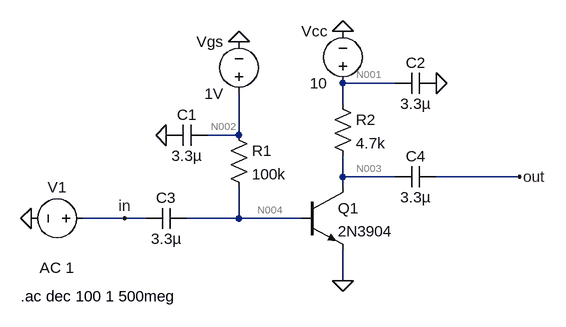
[diagram p0: schematic lab2_2N3904_CE.asc]
lab2_2N3904_CE.asc, the LTspice schematic file:
Version 4.1
SHEET 1 880 680
WIRE 304 -48 224 -48
WIRE 224 -16 224 -48
WIRE 64 32 64 -32
WIRE 64 32 16 32
WIRE 224 96 224 64
WIRE 304 96 224 96
WIRE 496 96 368 96
WIRE 224 112 224 96
WIRE -112 160 -176 160
WIRE -80 160 -112 160
WIRE 64 160 64 112
WIRE 64 160 -16 160
WIRE 160 160 64 160
WIRE 224 256 224 208
FLAG 224 256 0
FLAG 64 -112 0
FLAG 368 -48 0
FLAG -48 32 0
FLAG 496 96 out
FLAG -112 160 in
FLAG 224 -128 0
FLAG -256 160 0
SYMBOL npn 160 112 R0
SYMATTR InstName Q1
SYMATTR Value 2N3904
SYMBOL res 48 16 R0
SYMATTR InstName R1
SYMATTR Value 100k
SYMBOL cap 16 16 R90
WINDOW 0 0 32 VBottom 2
WINDOW 3 32 32 VTop 2
SYMATTR InstName C1
SYMATTR Value 3.3µ
SYMBOL res 208 -32 R0
SYMATTR InstName R2
SYMATTR Value 4.7k
SYMBOL cap 368 -64 R90
WINDOW 0 0 32 VBottom 2
WINDOW 3 32 32 VTop 2
SYMATTR InstName C2
SYMATTR Value 3.3µ
SYMBOL cap -16 144 R90
WINDOW 0 0 32 VBottom 2
WINDOW 3 32 32 VTop 2
SYMATTR InstName C3
SYMATTR Value 3.3µ
SYMBOL voltage 64 -16 R180
WINDOW 0 24 96 Left 2
WINDOW 3 24 16 Left 2
WINDOW 123 0 0 Left 0
WINDOW 39 0 0 Left 0
SYMATTR InstName Vgs
SYMATTR Value 1V
SYMBOL voltage 224 -32 R180
WINDOW 0 24 96 Left 2
WINDOW 3 24 16 Left 2
WINDOW 123 0 0 Left 0
WINDOW 39 0 0 Left 0
SYMATTR InstName Vcc
SYMATTR Value 10
SYMBOL cap 368 80 R90
WINDOW 0 0 32 VBottom 2
WINDOW 3 32 32 VTop 2
SYMATTR InstName C4
SYMATTR Value 3.3µ
SYMBOL voltage -160 160 R90
WINDOW 0 -32 56 VBottom 2
WINDOW 3 32 56 VTop 2
WINDOW 123 60 56 VTop 2
WINDOW 39 0 0 Left 0
SYMATTR InstName V1
SYMATTR Value ""
SYMATTR Value2 AC 1
TEXT -272 280 Left 2 !.ac dec 100 1 500meg

The netlist it stands for:
* lab2_2N3904_CE.asc
Q1 N003 N004 0 0 2N3904
R1 N002 N004 100k
C1 N002 0 3.3µ
R2 N001 N003 4.7k
C2 0 N001 3.3µ
C3 N004 in 3.3µ
Vgs N002 0 1V
Vcc N001 0 10
C4 out N003 3.3µ
V1 in 0 AC 1
.model NPN NPN
.model PNP PNP
.lib standard.bjt
.ac dec 100 1 500meg
.backanno
.end

* Results of the author's LTspice run, read from the files saved beside the schematic
* Operating Point, zero values left out:
*   V(n001) = 10 V
*   V(n002) = 1 V
*   V(n003) = 4.956 V
*   V(n004) = 656.1 mV
*   V(out) = 4.956 V
*   I(R1) = 3.439 µA
*   I(R2) = 1.073 mA
*   I(Vcc) = -1.073 mA
*   I(Vgs) = -3.439 µA
*   Ib(Q1) = 3.439 µA
*   Ic(Q1) = 1.073 mA
*   Ie(Q1) = -1.077 mA
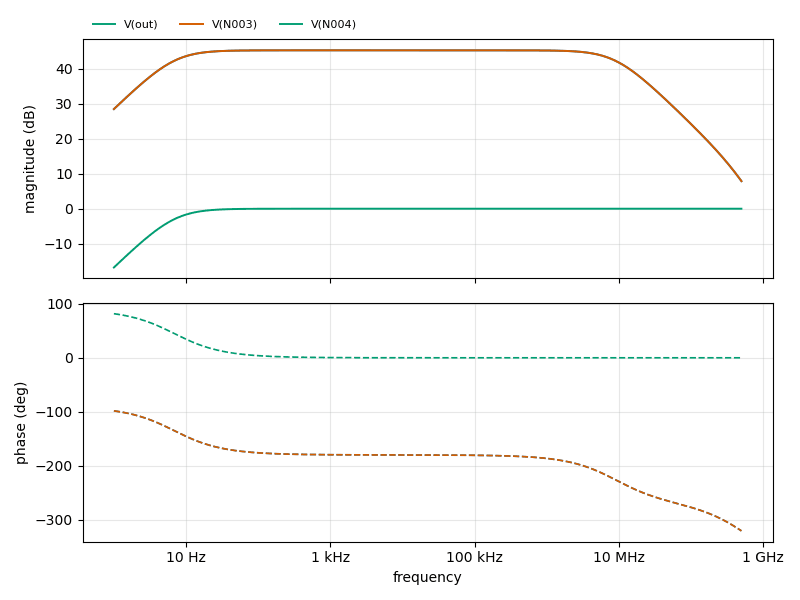
[diagram p1: AC Analysis of lab2_2N3904_CE.asc, plotted from the saved traces]
* AC Analysis, 1 run:
*   V(out): 28.50 dB at 1 Hz, 7.89 dB at 500 MHz, peak 45.31 dB at 7.762 kHz, 3 dB below the peak at 6.852 Hz and 8.993 MHz
*   V(N003): 28.50 dB at 1 Hz, 7.89 dB at 500 MHz, peak 45.31 dB at 7.762 kHz, 3 dB below the peak at 6.852 Hz and 8.993 MHz
*   V(N004): -16.81 dB at 1 Hz, -0.00 dB at 500 MHz, peak -0.00 dB at 500 MHz, 3 dB below the peak at 6.854 Hz